# EAGLE design Alpha-Num Single (EAGLE 9.6.2)
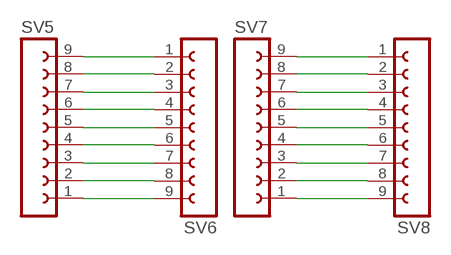
[diagram p0: schematic, sheet 1]

## Parts
SV5  FE09-1  [FE09]
SV6  FE09-1  [FE09]
SV7  FE09-1  [FE09]
SV8  FE09-1  [FE09]

## Nets
N$19: SV5.9 SV6.1
N$20: SV5.8 SV6.2
N$21: SV5.7 SV6.3
N$22: SV5.6 SV6.4
N$23: SV5.5 SV6.5
N$24: SV5.4 SV6.6
N$25: SV5.3 SV6.7
N$26: SV5.2 SV6.8
N$27: SV5.1 SV6.9
N$28: SV7.9 SV8.1
N$29: SV7.8 SV8.2
N$30: SV7.7 SV8.3
N$31: SV7.6 SV8.4
N$32: SV7.5 SV8.5
N$33: SV7.4 SV8.6
N$34: SV7.3 SV8.7
N$35: SV7.2 SV8.8
N$36: SV7.1 SV8.9

## Library data of the parts
SV5-SV8 = con-lsta:FE09-1: FEMALE HEADER; OC_FARNELL: unknown; OC_NEWARK: unknown

## Board
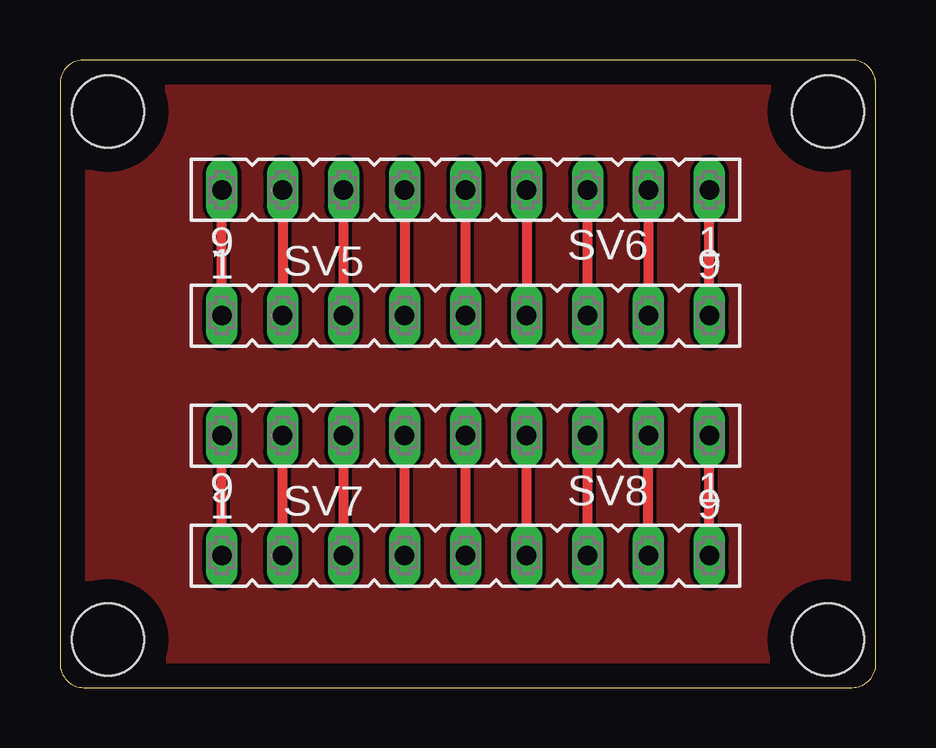
[diagram p1: board, top side]
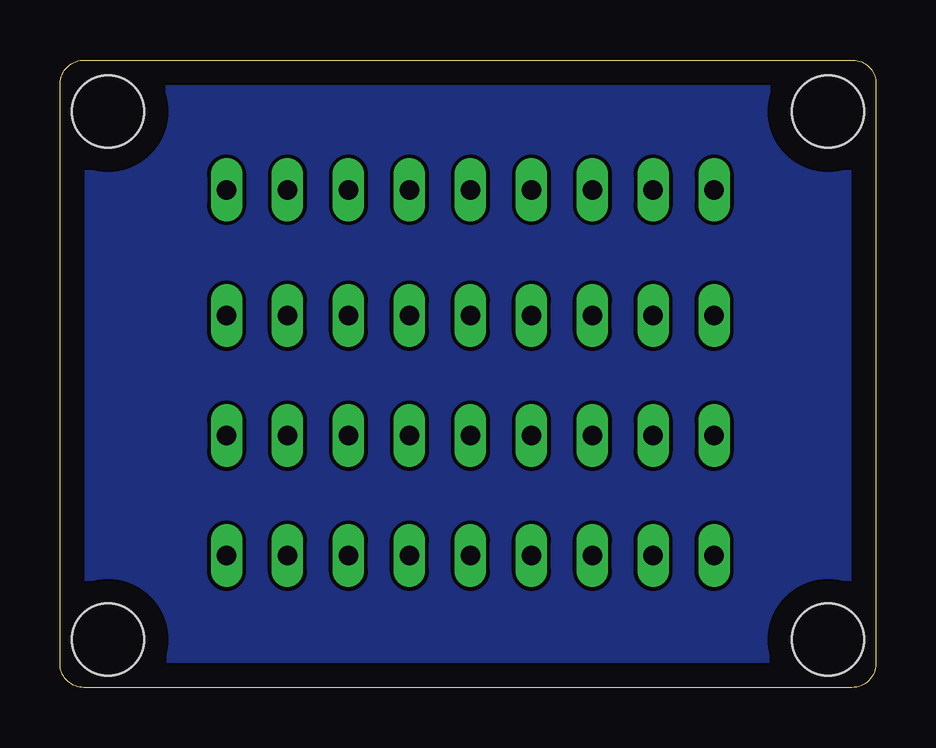
[diagram p2: board, bottom side, seen from below]

Size 34 x 26.15 mm. Coordinates in mm from the lower left corner, seen from the top.
Outline: 0,25.15 0,1 arc90 1,0 33,0 arc90 34,1 34,25.15 arc90 32.95,26.15 0.95,26.15 arc90 0,25.15
Copper layers (1*16): Top 0.035mm / dielectric 1.5mm / Bottom 0.035mm
Design rules "default": minimum track width 6mil, minimum drill 0.35mm, track to track 6mil, track to pad 6mil, pad to pad 6mil, via to via 6mil, smd to smd 6mil, copper to edge 40mil, drill to drill 6mil, minimum pad ring 10mil, minimum via ring 8mil, stop-mask expansion 4mil, vias tented up to drill 0.5mm, thermal gap 10mil
Holes 3 mm at 2,24 32,24 32,2 2,2

### Footprints (pad centres in the part's own frame; a part is rotated, then mirrored left to right if it is on the bottom)
FE09 = drill 0.813 long: 1 -10.16,0; 2 -7.62,0; 3 -5.08,0; 4 -2.54,0; 5 0,0; 6 2.54,0; 7 5.08,0; 8 7.62,0; 9 10.16,0

### Placement (x,y rotation side)
SV5  16.9,15.5 0 top
SV6  16.9,20.74 180 top
SV7  16.9,5.5 0 top
SV8  16.9,10.5 180 top

### Tracks (layer width: path | path; a pad name or v marks a point on that pad's centre or on a via)
GND
  pour Top: 0,0 0,26 34,26 34,0
  pour Bottom: 0,0 0,26 34,26 34,0
N$19
  Top 0.406: SV5.9 SV6.1
N$20
  Top 0.406: SV6.2 SV5.8
N$21
  Top 0.406: SV5.7 SV6.3
N$22
  Top 0.406: SV6.4 SV5.6
N$23
  Top 0.406: SV5.5 SV6.5
N$24
  Top 0.406: SV6.6 SV5.4
N$25
  Top 0.406: SV5.3 SV6.7
N$26
  Top 0.406: SV6.8 SV5.2
N$27
  Top 0.406: SV5.1 SV6.9
N$28
  Top 0.406: SV7.9 SV8.1
N$29
  Top 0.406: SV7.8 SV8.2
N$30
  Top 0.406: SV7.7 SV8.3
N$31
  Top 0.406: SV7.6 SV8.4
N$32
  Top 0.406: SV7.5 SV8.5
N$33
  Top 0.406: SV7.4 SV8.6
N$34
  Top 0.406: SV7.3 SV8.7
N$35
  Top 0.406: SV7.2 SV8.8
N$36
  Top 0.406: SV7.1 SV8.9